# Altium schematic sheet Main_IC_Sheet.SchDoc: Main IC - ATMEG
size A4; DrawnBy: Jasper Maes; DocumentNumber: 3; Revision: /; SheetNumber: 3; SheetTotal: 4
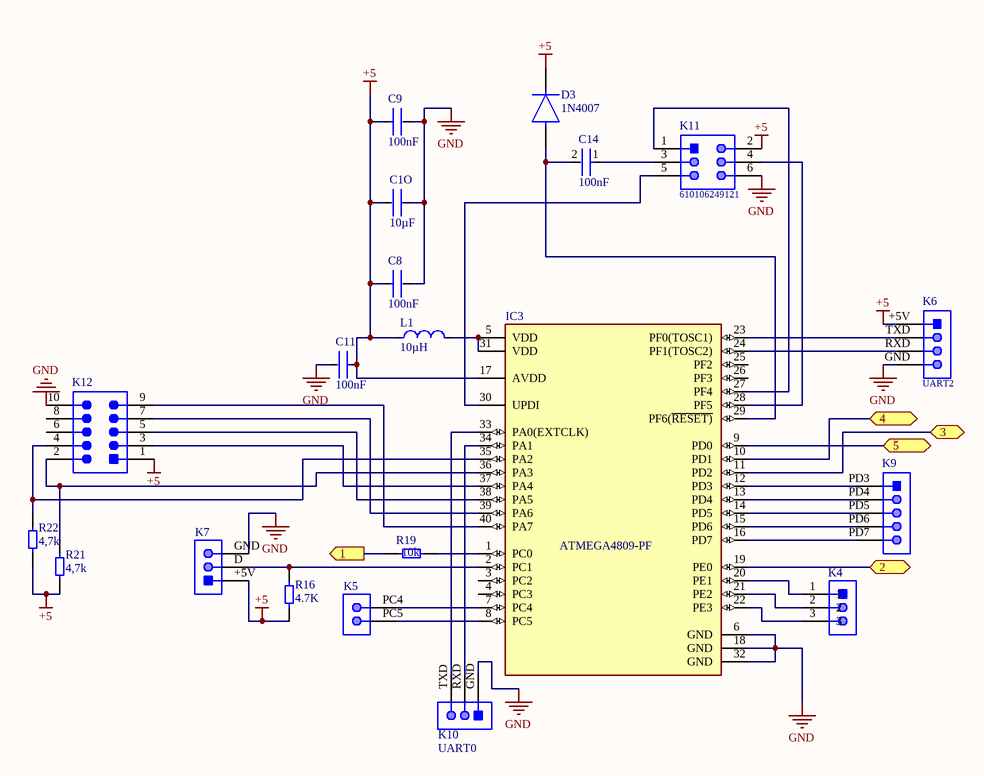
[diagram p0: Main_IC_Sheet.SchDoc]

## Parts
C1O  10µF  [CAPPRD200W52D525H1200]
C8  100nF  [FP-C0805C-DN-IPC_A]
C9  100nF  [FP-C0805C-DN-IPC_A]
C11  100nF  [FP-C0805C-DN-IPC_A]
C14  100nF  [FP-C0805C-DN-IPC_A]
D3  1N4007  [FP-1N4007-MFG]
IC3  ATMEGA4809-PF  [FP-C04-016-MFG]
K4  (no value)  [MOLX-22-28-4033_V]
K5  (no value)  [TECO-5-146280-2_V]
K6  UART2  [61300411121]
K7  (no value)  [MOLX-22-28-4033_V]
K9  691701320005B  [61300511121]  (value not drawn)
K10  UART0  [MOLX-22-28-4033_V]
K11  610106249121  [SMTC-TSW-103-08-L-D_V]
K12  (no value)  [TECO-1-1634688-0-10_V]
L1  10µH  [FP-IR02-MFG]
R16  4.7K  [RESC2013X60X40ML20T25]
R19  10k  [RESC2013X60X40ML20T25]
R21  4,7k  [RESC2013X60X40ML20T25]
R22  4,7k  [RESC2013X60X40ML20T25]

## Ports
1 (out, see Sturing_Bout[2C]), 2 (bidir, see Voeding[1C]), 3 (bidir, see Voeding[3C]), 4 (bidir, see temperatuursmeting[2B]), 5 (bidir, see temperatuursmeting[2B])

## Nets
+5: C1O.2 C8.1 C9.1 C11.1 D3.1(C) IC3.17(AVDD) K6.+5V K7.+5V K11.2 K12.1 L1.1 R16.2 R21.1 R22.1
GND: C1O.1 C8.2 C9.2 C11.2 IC3.6(GND) IC3.18(GND) IC3.32(GND) K6.GND K7.GND K10.GND K11.6 K12.10
1: R19.1 ; port 1
2: IC3.19(PE0) ; port 2
3: IC3.11(PD2) ; port 3
4: IC3.10(PD1) ; port 4
5: IC3.9(PD0) ; port 5
NetC14_1: C14.1 K11.3
NetC14_2: C14.2 D3.2(A) IC3.29(PF6(~{RESET)})
NetIC3_1: IC3.1(PC0) R19.2
NetIC3_2: IC3.2(PC1) K7.D R16.1
NetIC3_5: IC3.5(VDD) IC3.31(VDD) L1.2
NetIC3_7: IC3.7(PC4) K5.PC4
NetIC3_8: IC3.8(PC5) K5.PC5
NetIC3_12: IC3.12(PD3) K9.PD3
NetIC3_13: IC3.13(PD4) K9.PD4
NetIC3_14: IC3.14(PD5) K9.PD5
NetIC3_15: IC3.15(PD6) K9.PD6
NetIC3_16: IC3.16(PD7) K9.PD7
NetIC3_20: IC3.20(PE1) K4.1
NetIC3_21: IC3.21(PE2) K4.2
NetIC3_22: IC3.22(PE3) K4.3
NetIC3_23: IC3.23(PF0(TOSC1)) K6.TXD
NetIC3_24: IC3.24(PF1(TOSC2)) K6.RXD
NetIC3_27: IC3.27(PF4) K11.1
NetIC3_28: IC3.28(PF5) K11.4
NetIC3_30: IC3.30(UPDI) K11.5
NetIC3_33: IC3.33(PA0(EXTCLK)) K10.TXD
NetIC3_34: IC3.34(PA1) K10.RXD
NetIC3_35: IC3.35(PA2) K12.4 R22.2
NetIC3_36: IC3.36(PA3) K12.2 R21.2
NetIC3_37: IC3.37(PA4) K12.3
NetIC3_38: IC3.38(PA5) K12.5
NetIC3_39: IC3.39(PA6) K12.7
NetIC3_40: IC3.40(PA7) K12.9

Not connected (* = marked no-connect by the designer): IC3 3(PC2) 4(PC3) 25(PF2) 26(PF3); K12 6 8

## Library data of the parts
C1O C8 C9 C11 C14 = CMP-2007-00279-2: CAP CER 0.1UF 50V X7R 0805; Manufacturer Part Number: C0805C104K5RACTU; Manufacturer: KEMET; Value: 0.10 μF; Tolerance: 0.1; Temperature Coefficient: 30ppm/°C; Material: Ceramic; Device Class L2: Capacitors; Temperature Range Low: -55°C; Voltage Rating: 50 V; Digikey Description: CAP CER 0.1UF 50V X7R 0805; Category: Cap; ComponentLink2Description: Datasheet; Octopart: https://octopart.com/c0805c104k5ractu-kemet-143926; RoHS: TRUE; ComponentLink2URL: https://content.kemet.com/datasheets/KEM_C1003_C0G_SMD.pdf; Temperature Characteristic: X7R; Temperature: -55°C to +125°C; Height: 0.88mm; Temperature Range High: +125°C; Device Class L1: Passive Components; Automotive: No; Lead Free: Yes; Ipc Land Pattern Name: CAPC200125X78; Device Class L3: Ceramic Capacitors; Mouser Description: Cap Ceramic 0.1uF 50V X7R 10% SMD 2.0 x 1.2 mm 125 C Paper T/R; Capacitance: 0.10 μF; Package: C0805C-DN
D3 = CMP-123542-000001-1: Rectifier diode 1000 V 1 A DO-41, ,; Manufacturer: Diotec; Max Surge Forward Current: 27A; Forward Current: 1A; Max Junction Temp: +175°C; Reverse Voltage: 1000V; Value: 15pF; Peak Reverse Current: 5uA; Category: Diode; Temperature Range Low: -50°C; Automotive: No; Temperature: -50°C to +175°C; Lead Free: Yes; ComponentLink2Description: Datasheet; Max Repetitive Reverse Voltage: 1000V; ComponentLink2URL: https://datasheet.octopart.com/1N4007-Diotec-datasheet-62346875.pdf; Manufacturer Part Number: 1N4007; Device Class L3: Rectifier Diodes; Height: 2.8mm; Octopart: https://octopart.com/1n4007-diotec-4040411; Package: 1N4007; Temperature Range High: +175°C; Device Class L1: Discrete Semiconductors; Device Class L2: Diodes; RoHS: TRUE; Capacitance: 15pF; Ipc Land Pattern Name: DIOAD888W100L520D280
IC3 = CMP-06276-000616-1: IC MCU 8BIT 48KB FLASH 40DIP; RoHS Compliant: Yes
K4 K7 K10 = CMP-1676-00001-5: Male Header, Pitch 2.54 mm, 1 x 3 Position, Height 8.38 mm, Tail Length 3.18 mm, RoHS, Bulk; Manufacturer: Molex; Rows: 1; Voltage Rating: 250 V; Current Rating: 4 A; Min Operating Temperature: 0 degC; Lead Pitch: 0.1 inch; Packaging: Bulk; Contact Finish: Gold; RoHSCompliant: true; Contact Material: Brass; PackageReference: 22-28-4033; REACH SVHC: Unknown; PackageDescription: Male Header, Pitch 2.54 mm, 1 x 3 Position, Height 8.38 mm, Tail Length 3.18 mm; ComponentLink2URL: http://www.molex.com/pdm_docs/sd/022284033_sd.pdf; Height: 8.38 mm; Mounting Technology: Through Hole; ComponentLink1Description: Manufacturer URL; Length: 7.62 mm; Mount: Through Hole; DatasheetVersion: Rev. G, 01/2012; Max Operating Temperature: 75 degC; ComponentLink2Description: Datasheet; Colour: Black; Pins: 3; Contact Plating: Gold; Package Quantity: 1; ComponentLink1URL: http://www.molex.com/
K5 = CMP-2000-07492-1: Male Header, Pitch 2.54 mm, 1 x 2 Position, Height 8.21 mm, Tail Length 3.05 mm, -65 to 105 degC, RoHS, Bulk; Manufacturer: TE Connectivity; Mating Connector Lock: No(Without); Number of Positions: 2; Pitch: 2.54mm; PCB Mounting Orientation: Vertical; Keyed: No; Case\/Package: 100; Mating Post Length: 0.23inch; High Temperature Housing: Yes; Max Current Rating: 5A; PCB Thickness: 0.063inch; PCB Mount Retention: Without; Approvals: CSA; Current Rating: 3A; Radiation Hardening: No; Length: 4.67mm; Contact Mating Length: 0.23inch; Connector Type: Header; Number of Rows: 1; Termination Post Length: 0.12inch; Board Standoff: No(Without); Max Operating Temperature: 105degC; Contact Shape: Square; Selectively Loaded: No(Without); Gasket: No(Without); Number of Contacts: 2; Contact Gender: Male; Mating Alignment: No(Without); Manufacturer URL: http://www.te.com/; Datasheet URL: http://www.te.com/commerce/DocumentDelivery/DDEController?Action=showdoc&DocId=Customer+Drawing%7F146280%7FH1%7Fpdf%7FEnglish%7FENG_CD_146280_H1.pdf%7F5-146280-2; Mount: ThroughHole; Orientation: Straight; Packaging: Carton; Package Reference: 5-146280-2; Package Quantity: 500; Stabilizers: No(Without); Row Spacing: 2.54mm; Contact Material: CopperAlloy; Panel Mount Retention: No(Without); Datasheet Version: Rev. H1, 08/2016; Housing Colour: Black; Colour: Black; Package Description: Male Header, Pitch 2.54 mm, 1 x 2 Position, Height 8.21 mm, Tail Length 3.05 mm; Contact Plating: Matte; Housing Material: Polymer; Contact Protection: No(Without); Min Operating Temperature: -65degC; Mounting Technology: ThroughHole; Flammability Rating: UL94V-0; RoHSCompliant: true; Termination: ThroughHole; Depth: 2.34mm; High Speed Serial Data Connector: No
K6 = CMP-1502-01064-1: THT Vertical Pin Header WR-PHD, Pitch 2.54 mm, Single Row, 4 pins; Manufacturer: Wurth Elektronik; Withstanding Voltage: 500VAC; Rated Current: 3A; Working Voltage: 250VAC; Pin Number: 4; Gender: Male; Contact Resistance: 20mOhm; Pitch: 2.54mm; Manufacturer URL: http://www.we-online.de; Operating Temperature: -40to105degC; Packaging: Bag; Mounting Technology: THT; Package Reference: 61300411121; Datasheet URL: https://katalog.we-online.de/em/datasheet/6130xx11121.pdf; Publisher: WurthElektronik; Part Number: 61300411121; Row Number: Single; Orientation: Vertical
K9 = CMP-1502-01995-1: Serie 7013 B - 3.81mm Vertical PCB Header THR Type with Flanges WR-TBL, 5 pin; Manufacturer: Wurth Elektronik; Gender: Male; Pin Number: 5; Mounting Technology: SMT; Part Number: 691701320005B; Package Reference: 691701320005B; Pitch: 3.81mm; Operating Temperature: -40to105degC; Datasheet URL: http://katalog.we-online.de/em/datasheet/6917013200xxB.pdf; Publisher: WurthElektronik; Manufacturer URL: http://www.we-online.de; Packaging: TapeandReelwithCap
K11 = CMP-1502-01146-1: SMT Angled Pin Header WR-PHD, Pitch 2.54 mm, Dual Row, 6 pins; Manufacturer: Wurth Elektronik; Contact Resistance: 20mOhm; Gender: Male; Withstanding Voltage: 600VAC; Working Voltage: 250VAC; Rated Current: 3A; Pitch: 2.54mm; Pin Number: 6; Package Reference: 610106249121; Mounting Technology: SMT; Row Number: Dual; Manufacturer URL: http://www.we-online.de; Operating Temperature: -40to105degC; Publisher: WurthElektronik; Datasheet URL: https://katalog.we-online.de/em/datasheet/6101xx249121.pdf; Packaging: TapeandReel; Orientation: Angled; Part Number: 610106249121
K12 = CMP-2000-05854-1: Male Header, Pitch 2.54 mm, 2 x 5 Postion, Height 9.15 mm, Tail Length 3.2 mm, -40 to 105 degC, RoHS, Bulk; Manufacturer: TE Connectivity; PartNumber: 1-1634688-0; No. of Rows: 2; SVHC: ToBeAdvised; Package Version: Rev. C2, 02/2011; No. of Contacts: 10Contacts; Pitch: 2.54mm; No. of Positions: 10; Contact Termination Type: ThroughHole; Package Description: 10-Pin Connector, Body 20.35 x 8.7 mm, Pitch 2.54 mm; Orientation: Straight; Gender: Header; Mounting Technology: ThroughHole; Product Range: -; Datasheet Version: Rev. C2, 02/2011; Contact Material: Brass; Package URL: https://datasheet.ciiva.com/6831/eng-cd-1634688-c2-6831201.pdf; Package Reference: 1-1634688-0; Pitch Spacing: 2.54mm; Contact Plating: GoldPlatedContacts; Manufacturer URL: http://www.te.com/; Datasheet URL: https://datasheet.ciiva.com/6831/eng-cd-1634688-c2-6831201.pdf
L1 = CMP-03630-000001-1: IR-2 10 10% B08; Obsolete Part: true; Manufacturer: Vishay Dale; Manufacturer Part Number: IR02BH100K; Core Material: Iron; Value: 10uH; Test Frequency: 7.9MHz; Saturation Current: 130mA; Series Resistance: 3.7Ω; Q Factor: 55; Self Resonant Frequency: 50MHz; Device Class L2: Inductors; ComponentLink2Description: Datasheet; Temperature Range Low: -55°C; Digikey Description: IR-2 10 10% B08; Temperature Range High: +105°C; Inductance: 10uH; Height: 3.05mm; Package: IR02; Tolerance: 10%; Device Class L1: Passive Components; Category: Ind; Device Class L3: Fixed Inductors; RoHS: TRUE; Octopart: https://octopart.com/ir02bh100k-vishay+dale-39675774; Temperature: -55°C to +105°C; Ipc Land Pattern Name: CAPAD1147W70L838D305; Lead Free: Yes; ComponentLink2URL: https://datasheet.ciiva.com/8536/ir-8536517.pdf; Automotive: No; Mouser Description: Fixed Inductors 10uH 10%
R16 R19 R21 R22 = CMP-2001-00629-1_1: Part Number: ERA6AEB332V; Manufacturer: Panasonic